# Altium schematic sheet AjusteVoltajeTX.SchDoc
size A4
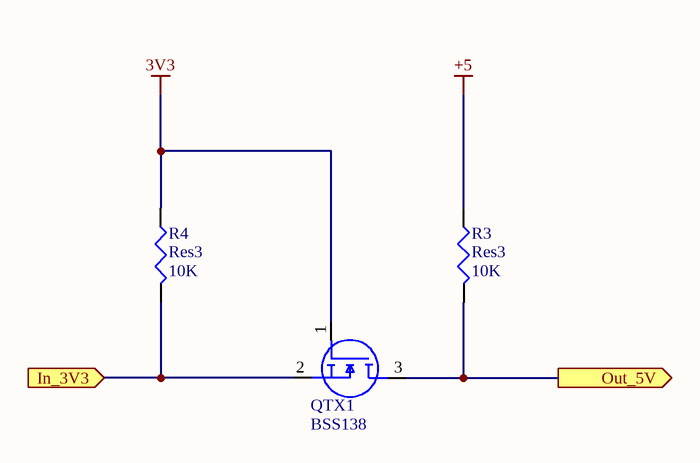
[diagram p0: AjusteVoltajeTX.SchDoc]

## Parts
QTX1  BSS138  [SOT95P240X120-3N]
R3  Res3  value 10K  [J1-0603]
R4  Res3  value 10K  [J1-0603]

## Ports
In_3V3 (in), Out_5V (out)

## Nets
3V3: QTX1.1(G) R4.1
+5: R3.1
In_3V3: QTX1.2(S) R4.2 ; port In_3V3
Out_5V: QTX1.3(D) R3.2 ; port Out_5V

## Library data of the parts
QTX1 = BSS138: MOSFET (N-Channel); Manufacturer_Name: ON Semiconductor; Datasheet Link: https://www.onsemi.com/pub/Collateral/BSS138-D.PDF; Height: 1.2mm; Manufacturer_Part_Number: BSS138; Arrow Part Number: BSS138; Arrow Price/Stock: https://www.arrow.com/en/products/bss138/on-semiconductor; Mouser Part Number: 512-BSS138; Mouser Price/Stock: https://www.mouser.co.uk/ProductDetail/ON-Semiconductor-Fairchild/BSS138?qs=HK%252BeIG1iaahCeqBvjB4arg%3D%3D
R3 R4 = Res3: Resistor; Published: 8-Jun-2000; LatestRevisionDate: 29-May-2009; LatestRevisionNote: IPC-7351 Footprint Added.; PackageReference: J1-0603; Publisher: Altium Limited; PackageDescription: Chip Resistor